# EAGLE design armwiz-board (EAGLE 6.5.0)
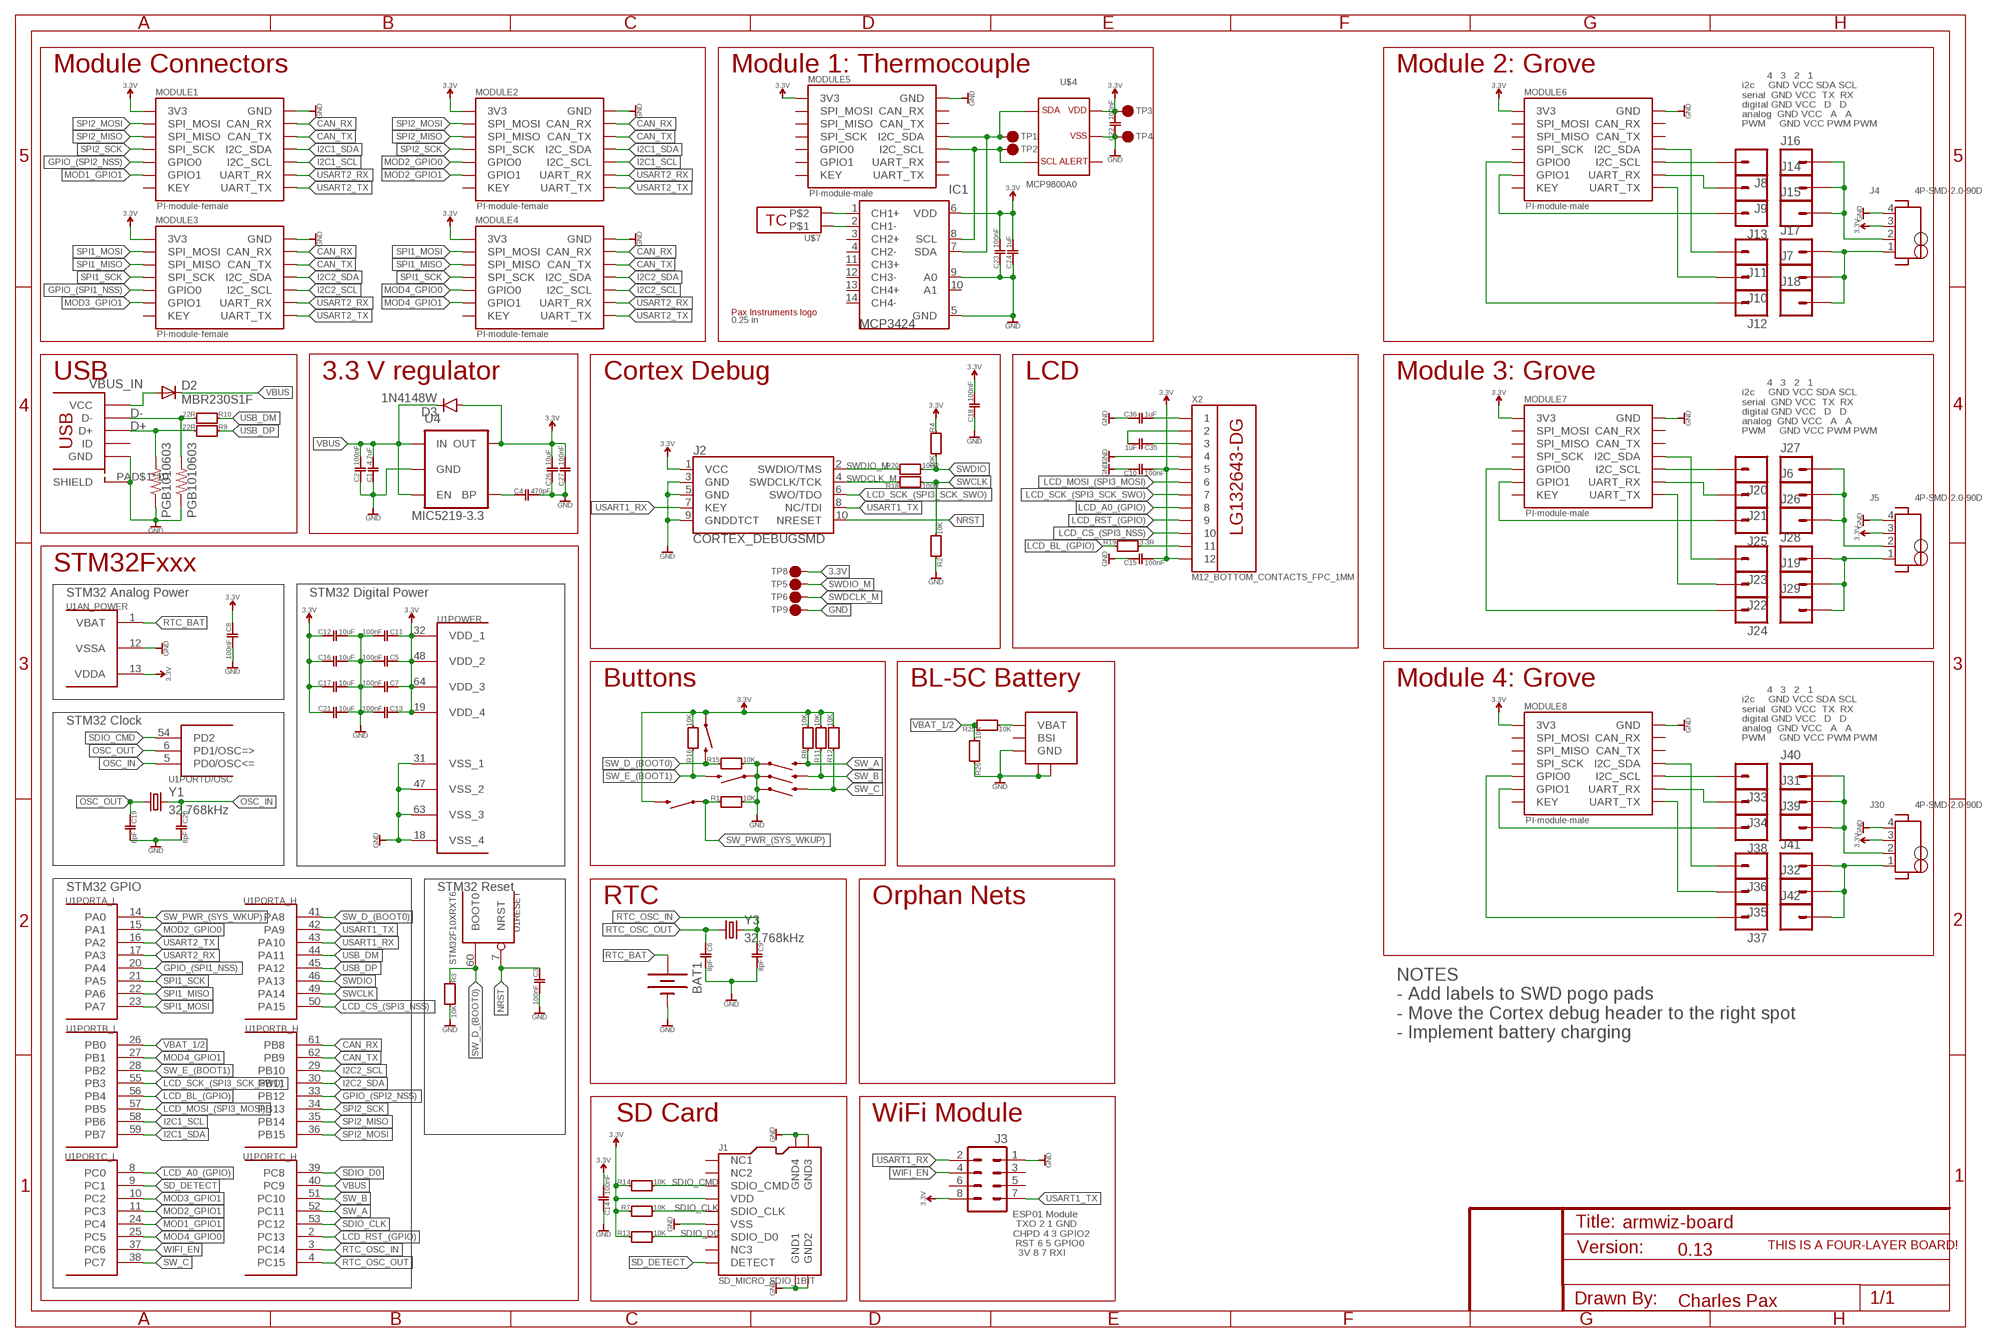
[diagram p0: schematic, sheet 1]

## Parts
BAT1  BATTERY12MM  [BATTCON_12MM]
C1  4.7uF  C0402_4.7UF  [0402]
C2  100nF  C0402_100NF  [0402]
C3  100nF  C0402_100NF  [0402]
C4  470pF  C0402_470PF  [0402]
C5  100nF  C0402_100NF  [0402]
C6  8pF  C0402_8PF  [0402]
C7  100nF  C0402_100NF  [0402]
C8  100nF  C0402_100NF  [0402]
C9  8pF  C0402_8PF  [0402]
C10  100nF  C0402_100NF  [0402]
C11  100nF  C0402_100NF  [0402]
C12  10uF  C0402_10UF  [0402]
C13  100nF  C0402_100NF  [0402]
C14  100nF  C0402_100NF  [0402]
C15  100nF  C0402_100NF  [0402]
C16  10uF  C0402_10UF  [0402]
C17  10uF  C0402_10UF  [0402]
C18  100nF  C0402_100NF  [0402]
C19  8pF  C0402_8PF  [0402]
C20  8pF  C0402_8PF  [0402]
C21  10uF  C0402_10UF  [0402]
C22  100nF  C0402_100NF  [0402]
C23  100nF  C0402_100NF  [0402]
C24  1uF  C0402_1UF  [0402]
C26  10uF  C0402_10UF  [0402]
C27  100nF  C0402_100NF  [0402]
C35  1uF  C0402_1UF  [0402]
C36  1uF  C0402_1UF  [0402]
D2  MBR230S1F  SPARKFUN-DISCRETESEMI_DIODESOD123SOD123  [SOD123]
D3  1N4148W  DIODESOD123  [SOD-123]
IC1  MCP3424  [SO14]
J1  SD_MICRO_SDIO_1BIT  [SD_MICRO_1]
J2  CORTEX_DEBUGSMD  [SAMTECH_FTSH-105-01]
J3  M04X2  [2X4]
J4  4P-SMD-2.0-90D  GROVE-CONNECTOR-SMD-90D(4+2P-2.0)  [HW4-SMD-2.0-90D]
J5  4P-SMD-2.0-90D  GROVE-CONNECTOR-SMD-90D(4+2P-2.0)  [HW4-SMD-2.0-90D]
J6  M01SMD-4.5X1.5  [PAD-1.5X4.5]
J7  M01SMD-4.5X1.5  [PAD-1.5X4.5]
J8  M01SMD-4.5X1.5  [PAD-1.5X4.5]
J9  M01SMD-4.5X1.5  [PAD-1.5X4.5]
J10  M01SMD-4.5X1.5  [PAD-1.5X4.5]
J11  M01SMD-4.5X1.5  [PAD-1.5X4.5]
J12  M01SMD-4.5X1.5  [PAD-1.5X4.5]
J13  M01SMD-4.5X1.5  [PAD-1.5X4.5]
J14  M01SMD-4.5X1.5  [PAD-1.5X4.5]
J15  M01SMD-4.5X1.5  [PAD-1.5X4.5]
J16  M01SMD-4.5X1.5  [PAD-1.5X4.5]
J17  M01SMD-4.5X1.5  [PAD-1.5X4.5]
J18  M01SMD-4.5X1.5  [PAD-1.5X4.5]
J19  M01SMD-4.5X1.5  [PAD-1.5X4.5]
J20  M01SMD-4.5X1.5  [PAD-1.5X4.5]
J21  M01SMD-4.5X1.5  [PAD-1.5X4.5]
J22  M01SMD-4.5X1.5  [PAD-1.5X4.5]
J23  M01SMD-4.5X1.5  [PAD-1.5X4.5]
J24  M01SMD-4.5X1.5  [PAD-1.5X4.5]
J25  M01SMD-4.5X1.5  [PAD-1.5X4.5]
J26  M01SMD-4.5X1.5  [PAD-1.5X4.5]
J27  M01SMD-4.5X1.5  [PAD-1.5X4.5]
J28  M01SMD-4.5X1.5  [PAD-1.5X4.5]
J29  M01SMD-4.5X1.5  [PAD-1.5X4.5]
J30  4P-SMD-2.0-90D  GROVE-CONNECTOR-SMD-90D(4+2P-2.0)  [HW4-SMD-2.0-90D]
J31  M01SMD-4.5X1.5  [PAD-1.5X4.5]
J32  M01SMD-4.5X1.5  [PAD-1.5X4.5]
J33  M01SMD-4.5X1.5  [PAD-1.5X4.5]
J34  M01SMD-4.5X1.5  [PAD-1.5X4.5]
J35  M01SMD-4.5X1.5  [PAD-1.5X4.5]
J36  M01SMD-4.5X1.5  [PAD-1.5X4.5]
J37  M01SMD-4.5X1.5  [PAD-1.5X4.5]
J38  M01SMD-4.5X1.5  [PAD-1.5X4.5]
J39  M01SMD-4.5X1.5  [PAD-1.5X4.5]
J40  M01SMD-4.5X1.5  [PAD-1.5X4.5]
J41  M01SMD-4.5X1.5  [PAD-1.5X4.5]
J42  M01SMD-4.5X1.5  [PAD-1.5X4.5]
MODULE1  PI-module-female  PAX_MODULE_EDGE_FEMALE_HOST  [M07X2_2MM_EDGE]
MODULE2  PI-module-female  PAX_MODULE_EDGE_FEMALE_HOST  [M07X2_2MM_EDGE]
MODULE3  PI-module-female  PAX_MODULE_EDGE_FEMALE_HOST  [M07X2_2MM_EDGE]
MODULE4  PI-module-female  PAX_MODULE_EDGE_FEMALE_HOST  [M07X2_2MM_EDGE]
MODULE5  PI-module-male  PAX_MODULE_EDGE_MALE_MODULE  [M07X2_2MM_EDGE]
MODULE6  PI-module-male  PAX_MODULE_EDGE_MALE_MODULE  [M07X2_2MM_EDGE]
MODULE7  PI-module-male  PAX_MODULE_EDGE_MALE_MODULE  [M07X2_2MM_EDGE]
MODULE8  PI-module-male  PAX_MODULE_EDGE_MALE_MODULE  [M07X2_2MM_EDGE]
R1  10K  R0402_10K  [0402]
R2  10K  R0402_10K  [0402]
R3  10K  R0402_10K  [0402]
R4  10K  R0402_10K  [0402]
R7  10K  R0402_10K  [0402]
R8  10K  R0402_10K  [0402]
R9  22R  R0402_22R  [R0402]
R10  22R  R0402_22R  [R0402]
R11  10K  R0402_10K  [0402]
R12  10K  R0402_10K  [0402]
R13  10K  R0402_10K  [0402]
R14  10K  R0402_10K  [0402]
R15  10K  R0402_10K  [0402]
R16  10K  R0402_10K  [0402]
R18  100R  R0402_100R  [0402]
R19  3.3R  R0402_3.3R  [0402]
R20  100R  R0402_100R  [0402]
R25  10K  R0402_10K  [0402]
R26  10K  R0402_10K  [0402]
S1  SWITCH-MOMENTARY-2SMD  [TACTILE_SWITCH_SMD]
S2  SWITCH-MOMENTARY-2SMD  [TACTILE_SWITCH_SMD]
S3  SWITCH-MOMENTARY-2SMD  [TACTILE_SWITCH_SMD]
S4  SWITCH-MOMENTARY-2SMD  [TACTILE_SWITCH_SMD]
S5  SWITCH-MOMENTARY-2SMD  [TACTILE_SWITCH_SMD]
S6  SWITCH-MOMENTARY-2SMD  [TACTILE_SWITCH_SMD]
TP1  M01_TH  [M01_TH]
TP2  M01_TH  [M01_TH]
TP3  M01_TH  [M01_TH]
TP4  M01_TH  [M01_TH]
TP5  M01_PAD_1MM  [PAD_1MM]
TP6  M01_PAD_1MM  [PAD_1MM]
TP8  M01_PAD_1MM  [PAD_1MM]
TP9  M01_PAD_1MM  [PAD_1MM]
U1  STM32F10XRXT6  [TQFP64]
U4  MIC5219-3.3V  V_REG_LDOSMD  [SOT23-5]
U$1  USB_MICROSMT+THRUHULE  [USB_MICRO_THRUHOLE]
U$2  FOUR_LAYER_WARNING  [FOUR_LAYER_WARNING]
U$3  BL-5C-CONNECTOR  [BL-5C-CONNECTOR]
U$4  MCP9800A0  [SOT23-5L]
U$5  LG132643-DG  [LG132643-DG]
U$7  THERMOCOUPLE_MINI_INSIDE  [THERMOCOUPLE_CLIP_INSIDE]
U$8  0.25 in  PAX-LOGO_0.25IN  [PAX-LOGO-0.25IN]
X2  M12_BOTTOM_CONTACTS_FPC_1MM  [FPC_12P_1MM]
Y1  32.768kHz  CRYSTAL3.2X1.5MM  [CRYSTAL-SMD-3.2X1.5MM]
Y3  32.768kHz  CRYSTAL3.2X1.5MM  [CRYSTAL-SMD-3.2X1.5MM]
Z1  PGB1010603  SPARKFUN-RESISTORS_RESISTOR0603-RES  [SPARKFUN-RESISTORS_0603-RES]
Z2  PGB1010603  SPARKFUN-RESISTORS_RESISTOR0603-RES  [SPARKFUN-RESISTORS_0603-RES]

## Nets
3.3V: C5.1 C7.1 C8.1 C10.2 C11.1 C12.1 C13.1 C14.2 C15.2 C16.1 C17.1 C18.2 C21.1 C26.2 C27.2 D3.A J1.4(VDD) J2.1(VCC) J3.8 MODULE1.P$1(3V3) MODULE2.P$1(3V3) MODULE3.P$1(3V3) MODULE4.P$1(3V3) R4.2 R7.2 R8.1 R11.1 R12.1 R13.2 R14.2 R16.1 S4.1 S6.3 TP8.P$1 U1.13(AN_POWER:VDDA) U1.19(POWER:VDD_4) U1.32(POWER:VDD_1) U1.48(POWER:VDD_2) U1.64(POWER:VDD_3) U4.5(OUT) X2.5 X2.12
3.3V_1: C22.2 C23.2 C24.2 IC1.6(VDD) MODULE5.P$13(3V3) TP3.P$1 U$4.1 ; supply symbol labelled 3.3V
3.3V_2: J4.3 MODULE6.P$13(3V3) ; supply symbol labelled 3.3V
3.3V_3: J5.3 MODULE7.P$13(3V3) ; supply symbol labelled 3.3V
3.3V_4: J30.3 MODULE8.P$13(3V3) ; supply symbol labelled 3.3V
CAN_RX: MODULE1.P$4(CAN_RX) MODULE2.P$4(CAN_RX) MODULE3.P$4(CAN_RX) MODULE4.P$4(CAN_RX) U1.61(PORTB_H:PB8)
CAN_TX: MODULE1.P$6(CAN_TX) MODULE2.P$6(CAN_TX) MODULE3.P$6(CAN_TX) MODULE4.P$6(CAN_TX) U1.62(PORTB_H:PB9)
D+: R9.1 U$1.PIN$3(D+) Z1.2
D-: R10.1 U$1.PIN$2(D-) Z2.2
GND [Ground]: BAT1.GND(-) C1.1 C2.1 C3.2 C4.2 C5.2 C6.2 C7.2 C8.2 C9.2 C10.1 C11.2 C12.2 C13.2 C14.1 C15.1 C16.2 C17.2 C18.1 C19.2 C20.2 C21.2 C26.1 C27.1 C36.1 J1.6(VSS) J1.G1(GND1) J1.G2(GND2) J1.G3(GND3) J1.G4(GND4) J2.3(GND) J2.5(GND) J2.9(GNDDTCT) J3.1 MODULE1.P$2(GND) MODULE2.P$2(GND) MODULE3.P$2(GND) MODULE4.P$2(GND) R1.1 R2.2 R3.1 R15.1 R26.2 S1.1 S2.1 S3.1 S5.1 TP9.P$1 U1.12(AN_POWER:VSSA) U1.18(POWER:VSS_4) U1.31(POWER:VSS_1) U1.47(POWER:VSS_2) U1.63(POWER:VSS_3) U4.2(GND) U$1.PAD$1(SHIELD) U$1.PAD$2(SHIELD) U$1.PAD$3(SHIELD) U$1.PAD$4(SHIELD) U$1.PAD$5(SHIELD) U$1.PAD$6(SHIELD) U$1.PAD$7(SHIELD) U$1.PAD$8(SHIELD) U$1.PAD$9(SHIELD) U$1.PAD$10(SHIELD) U$1.PIN$5(GND) U$3.P$3(GND) U$3.P$4 U$3.P$5 X2.4 Z1.1 Z2.1
GND_1 [Ground]: C22.1 C23.1 C24.1 IC1.5(GND) IC1.9(A0) MODULE5.P$14(GND) TP4.P$1 U$4.2 ; supply symbol labelled GND
GND_2 [Ground]: J4.4 MODULE6.P$14(GND) ; supply symbol labelled GND
GND_3 [Ground]: J5.4 MODULE7.P$14(GND) ; supply symbol labelled GND
GND_4 [Ground]: J30.4 MODULE8.P$14(GND) ; supply symbol labelled GND
GPIO_(SPI1_NSS): MODULE3.P$9(GPIO0) U1.20(PORTA_L:PA4)
GPIO_(SPI2_NSS): MODULE1.P$9(GPIO0) U1.33(PORTB_H:PB12)
I2C1_SCL: MODULE1.P$10(I2C_SCL) MODULE2.P$10(I2C_SCL) U1.58(PORTB_L:PB6)
I2C1_SDA: MODULE1.P$8(I2C_SDA) MODULE2.P$8(I2C_SDA) U1.59(PORTB_L:PB7)
I2C2_SCL: MODULE3.P$10(I2C_SCL) MODULE4.P$10(I2C_SCL) U1.29(PORTB_H:PB10)
I2C2_SDA [3.3V power]: MODULE3.P$8(I2C_SDA) MODULE4.P$8(I2C_SDA) U1.30(PORTB_H:PB11)
LCD_A0_(GPIO): U1.8(PORTC_L:PC0) X2.8
LCD_BL_(GPIO): R19.2 U1.56(PORTB_L:PB4)
LCD_CS_(SPI3_NSS): U1.50(PORTA_H:PA15) X2.10
LCD_MOSI_(SPI3_MOSI): U1.57(PORTB_L:PB5) X2.6
LCD_RST_(GPIO): U1.2(PORTC_H:PC13) X2.9
LCD_SCK_(SPI3_SCK_SWO): J2.6(SWO/TDO) U1.55(PORTB_L:PB3) X2.7
MOD1_GPIO1: MODULE1.P$11(GPIO1) U1.24(PORTC_L:PC4)
MOD2_GPIO0: MODULE2.P$9(GPIO0) U1.15(PORTA_L:PA1)
MOD2_GPIO1: MODULE2.P$11(GPIO1) U1.11(PORTC_L:PC3)
MOD3_GPIO1: MODULE3.P$11(GPIO1) U1.10(PORTC_L:PC2)
MOD4_GPIO0: MODULE4.P$9(GPIO0) U1.25(PORTC_L:PC5)
MOD4_GPIO1: MODULE4.P$11(GPIO1) U1.27(PORTB_L:PB1)
N$1: C4.1 U4.4(BP)
N$4: R19.1 X2.11
N$5: J4.2 J14.P$1 J15.P$1 J16.P$1
N$13: J5.2 J6.P$1 J26.P$1 J27.P$1
N$16: R25.1 U$3.P$1(VBAT)
N$25: IC1.2(CH1-) U$7.P$1
N$26: IC1.1(CH1+) U$7.P$2
N$37: C35.1 X2.3
N$38: C35.2 X2.2
N$39: C36.2 X2.1
N$42: J4.1 J7.P$1 J17.P$1 J18.P$1
N$43: J5.1 J19.P$1 J28.P$1 J29.P$1
N$45: J20.P$1 MODULE7.P$6(I2C_SCL)
N$47: J21.P$1 MODULE7.P$4(UART_RX)
N$51: J8.P$1 MODULE6.P$6(I2C_SCL)
N$52: J9.P$1 MODULE6.P$4(UART_RX)
N$53: J10.P$1 MODULE6.P$2(UART_TX)
N$54: J11.P$1 MODULE6.P$8(I2C_SDA)
N$55: J13.P$1 MODULE6.P$3(GPIO1)
N$56: J12.P$1 MODULE6.P$5(GPIO0)
N$57: J22.P$1 MODULE7.P$2(UART_TX)
N$58: J23.P$1 MODULE7.P$8(I2C_SDA)
N$59: J25.P$1 MODULE7.P$3(GPIO1)
N$60: J24.P$1 MODULE7.P$5(GPIO0)
N$61: J30.2 J31.P$1 J39.P$1 J40.P$1
N$62: J30.1 J32.P$1 J41.P$1 J42.P$1
N$63: J33.P$1 MODULE8.P$6(I2C_SCL)
N$64: J34.P$1 MODULE8.P$4(UART_RX)
N$65: J35.P$1 MODULE8.P$2(UART_TX)
N$66: J36.P$1 MODULE8.P$8(I2C_SDA)
N$67: J38.P$1 MODULE8.P$3(GPIO1)
N$68: J37.P$1 MODULE8.P$5(GPIO0)
NRST: C3.1 J2.10(NRESET) U1.7(RESET:NRST)
OSC_IN: C20.1 U1.5(PORTD/OSC:PD0/OSC<=) Y1.P$2
OSC_OUT: C19.1 U1.6(PORTD/OSC:PD1/OSC=>) Y1.P$1
RTC_BAT [RTC battery]: BAT1.PWR@1(+) U1.1(AN_POWER:VBAT)
RTC_OSC_IN: C9.1 U1.3(PORTC_H:PC14) Y3.P$2
RTC_OSC_OUT: C6.1 U1.4(PORTC_H:PC15) Y3.P$1
SCL_1: IC1.8(SCL) MODULE5.P$6(I2C_SCL) TP2.P$1 U$4.4
SD_DETECT: J1.9(DETECT) U1.9(PORTC_L:PC1)
SDA_1: IC1.7(SDA) MODULE5.P$8(I2C_SDA) TP1.P$1 U$4.5
SDIO_CLK: J1.5(SDIO_CLK) R7.1 U1.53(PORTC_H:PC12)
SDIO_CMD: J1.3(SDIO_CMD) R14.1 U1.54(PORTD/OSC:PD2)
SDIO_D0: J1.7(SDIO_D0) R13.1 U1.39(PORTC_H:PC8)
SPI1_MISO: MODULE3.P$5(SPI_MISO) MODULE4.P$5(SPI_MISO) U1.22(PORTA_L:PA6)
SPI1_MOSI: MODULE3.P$3(SPI_MOSI) MODULE4.P$3(SPI_MOSI) U1.23(PORTA_L:PA7)
SPI1_SCK: MODULE3.P$7(SPI_SCK) MODULE4.P$7(SPI_SCK) U1.21(PORTA_L:PA5)
SPI2_MISO: MODULE1.P$5(SPI_MISO) MODULE2.P$5(SPI_MISO) U1.35(PORTB_H:PB14)
SPI2_MOSI: MODULE1.P$3(SPI_MOSI) MODULE2.P$3(SPI_MOSI) U1.36(PORTB_H:PB15)
SPI2_SCK: MODULE1.P$7(SPI_SCK) MODULE2.P$7(SPI_SCK) U1.34(PORTB_H:PB13)
SW_A: R8.2 S3.3 U1.52(PORTC_H:PC11)
SW_B: R11.2 S2.3 U1.51(PORTC_H:PC10)
SW_C: R12.2 S1.3 U1.38(PORTC_L:PC7)
SW_D_(BOOT0): R3.2 R15.2 S4.3 U1.41(PORTA_H:PA8) U1.60(RESET:BOOT0)
SW_E_(BOOT1): R16.2 S5.3 U1.28(PORTB_L:PB2)
SW_PWR_(SYS_WKUP): R1.2 S6.1 U1.14(PORTA_L:PA0)
SWCLK: R2.1 R18.1 U1.49(PORTA_H:PA14)
SWDCLK_M: J2.4(SWDCLK/TCK) R18.2 TP6.P$1
SWDIO: R4.1 R20.1 U1.46(PORTA_H:PA13)
SWDIO_M: J2.2(SWDIO/TMS) R20.2 TP5.P$1
USART1_RX: J2.7(KEY) J3.2 U1.43(PORTA_H:PA10)
USART1_TX: J2.8(NC/TDI) J3.7 U1.42(PORTA_H:PA9)
USART2_RX: MODULE1.P$12(UART_RX) MODULE2.P$12(UART_RX) MODULE3.P$12(UART_RX) MODULE4.P$12(UART_RX) U1.17(PORTA_L:PA3)
USART2_TX: MODULE1.P$14(UART_TX) MODULE2.P$14(UART_TX) MODULE3.P$14(UART_TX) MODULE4.P$14(UART_TX) U1.16(PORTA_L:PA2)
USB_DM: R10.2 U1.44(PORTA_H:PA11)
USB_DP: R9.2 U1.45(PORTA_H:PA12)
VBAT_1/2: R25.2 R26.1 U1.26(PORTB_L:PB0)
VBUS [3.3V power]: C1.2 C2.2 D2.C D3.C U1.40(PORTC_H:PC9) U4.1(IN) U4.3(EN)
VBUS_IN [3.3V power]: D2.A U$1.PIN$1(VCC)
WIFI_EN: J3.4 U1.37(PORTC_L:PC6)
Unconnected: IC1.3(CH2+) IC1.4(CH2-) IC1.10(A1) IC1.11(CH3+) IC1.12(CH3-) IC1.13(CH4+) IC1.14(CH4-) J1.1(NC1) J1.2(NC2) J1.8(NC3) J3.3 J3.5 J3.6 J4.SS1 J4.SS2 J5.SS1 J5.SS2 J30.SS1 J30.SS2 MODULE1.P$13(KEY) MODULE2.P$13(KEY) MODULE3.P$13(KEY) MODULE4.P$13(KEY) MODULE5.P$1(KEY) MODULE5.P$2(UART_TX) MODULE5.P$3(GPIO1) MODULE5.P$4(UART_RX) MODULE5.P$5(GPIO0) MODULE5.P$7(SPI_SCK) MODULE5.P$9(SPI_MISO) MODULE5.P$10(CAN_TX) MODULE5.P$11(SPI_MOSI) MODULE5.P$12(CAN_RX) MODULE6.P$1(KEY) MODULE6.P$7(SPI_SCK) MODULE6.P$9(SPI_MISO) MODULE6.P$10(CAN_TX) MODULE6.P$11(SPI_MOSI) MODULE6.P$12(CAN_RX) MODULE7.P$1(KEY) MODULE7.P$7(SPI_SCK) MODULE7.P$9(SPI_MISO) MODULE7.P$10(CAN_TX) MODULE7.P$11(SPI_MOSI) MODULE7.P$12(CAN_RX) MODULE8.P$1(KEY) MODULE8.P$7(SPI_SCK) MODULE8.P$9(SPI_MISO) MODULE8.P$10(CAN_TX) MODULE8.P$11(SPI_MOSI) MODULE8.P$12(CAN_RX) U$1.PIN$4(ID) U$3.P$2(BSI) U$4.3

## Notes on the sheet
- Module Connectors | Module 1: Thermocouple | Module 2: Grove
- 4   3   2   1
  i2c     GND VCC SDA SCL
  serial  GND VCC  TX  RX
  digital GND VCC   D   D
  analog  GND VCC   A   A
  PWM     GND VCC PWM PWM
- USB | 3.3 V regulator | Cortex Debug | LCD | Module 3: Grove
- 4   3   2   1
  i2c     GND VCC SDA SCL
  serial  GND VCC  TX  RX
  digital GND VCC   D   D
  analog  GND VCC   A   A
  PWM     GND VCC PWM PWM
- MIC5219-3.3
- STM32Fxxx
- STM32 Analog Power | STM32 Digital Power
- Buttons | BL-5C Battery | Module 4: Grove
- 4   3   2   1
  i2c     GND VCC SDA SCL
  serial  GND VCC  TX  RX
  digital GND VCC   D   D
  analog  GND VCC   A   A
  PWM     GND VCC PWM PWM
- STM32 Clock
- STM32 GPIO | STM32 Reset
- RTC | Orphan Nets
- NOTES
  - Add labels to SWD pogo pads
  - Move the Cortex debug header to the right spot
  - Implement battery charging
- SD Card | WiFi Module
- ESP01 Module
   TXO 2 1 GND
  CHPD 4 3 GPIO2
   RST 6 5 GPIO0
    3V 8 7 RXI
- 0.13
- Charles Pax

## Library data of the parts
BAT1 = PaxInstruments-Electromechanical:BATTERY: Battery Holders Various common sizes : AA, AAA, 20mm coin cell and 12mm coin cell. 20MM_4LEGS, BATT-10373; MF: Keystone Electronics; MPN: 3000TR
C1-C24 C26 C27 C35 C36 = PaxInstruments-RCL:C0402
D2 = PaxInstrument-T400:SPARKFUN-DISCRETESEMI_DIODE: Diode These are standard reverse protection diodes and small signal diodes. SMA package can handle up to about 1A. SOD-323 can handle about 200mA. What the SOD-323 package when ordering, there are some mfgs out there that are 5-pin packages.; MF: DIODES INC; MPN: MBR230S1F-7
D3 = SparkFun-DiscreteSemi:DIODE: Diode These are standard reverse protection diodes and small signal diodes. SMA package can handle up to about 1A. SOD-323 can handle about 200mA. What the SOD-323 package when ordering, there are some mfgs out there that are 5-pin packages.
IC1 = PaxInstruments-DigitalIC:MCP3424: 18-Bit, 4-Channel Sampling ANALOG-TO-DIGITAL CONVERTER with I2C? Interface Source: www.ti.com .. ADS7828.pdf; MF: Microchip Technology; MPN: MCP3424-E/SL
J1 = PaxInstruments-Connectors:SD_MICRO_SDIO_1BIT
J2 = SparkFun-Connectors:CORTEX_DEBUG: Cortex Debug Connector Datasheet <http://infocenter.arm.com/help/topic/com.arm.doc.faqs/attached/13634/cortex_debug_connectors.pdf>
J3 = SparkFun-Connectors:M04X2: .1" header, two rows of four.
J4 J5 J30 = PaxInstruments-Connectors:GROVE-CONNECTOR-SMD-90D(4+2P-2.0): 320110032
J6-J29 J31-J42 = SparkFun-Connectors:M01: Header 1 Standard 1-pin 0.1" header. Use with straight break away headers (SKU : PRT-00116), right angle break away headers (PRT-00553), swiss pins (PRT-00743), machine pins (PRT-00117), and female headers (PRT-00115). SMTSO-256-ET is a "flush mount" nut for a 4-40 screw. The older package used to be too tight, and did not allow it to sit properly thru the drill hit. The latest (0.165DIA) fits nice and snug.
MODULE1-MODULE8 = PaxInstruments-Connectors:PAX_MODULE; MF: Pax Instruments; MPN: PIxxxx
R1-R4 R7 R8 R11-R16 R25 R26 = PaxInstruments-RCL:R0402; VALUE: _10K
R9 R10 = PaxInstruments-Resistors:R0402
R18-R20 = PaxInstruments-RCL:R0402
S1-S6 = SparkFun-Electromechanical:SWITCH-MOMENTARY-2: Various NO switches- pushbuttons, reed, etc; MF: C&K Components; MPN: RS-187R05A2-DS MT RT
TP1-TP6 TP8 TP9 = PaxInstruments-Connectors:M01
U1 = stm32:STM32F10XRXT6: STM32F101/103 64pin LQFP
U4 = SparkFun:V_REG_LDO: Voltage Regulator LDO Standard 150mA LDO voltage regulator in SOT-23 layout. Micrel part MIC5205. BP (by-pass) pin is used to lower output noise with 470pF cap.; MF: Micrel; MPN: MIC5219-3.3YM5 TR
U$1 = blinkinlabs:USB_MICRO; MF: FCI; MPN: 10118194-0001LF
U$2 = SparkFun-Aesthetics:FOUR_LAYER_WARNING: Warning text which will appear on both the schematic and the board file, notifying viewers that the design is a four-layer PCB.
U$3 = PaxInstruments-Connectors:BL-5C-CONNECTOR; MPN: BC-4-3P (77H)
U$4 = PaxInstruments-DigitalIC:MCP9800; I2C_ADDRESS: 000; MF: Microchip Technology; MPN: MCP9800A0T-M/OT
U$5 = charlespax:LG132643-DG; MPN: LG132643-DW
U$7 = PaxInstruments-Connectors:THERMOCOUPLE_MINI; MF: Pax Instruments; MPN: PI1024 (2x)
U$8 = PaxInstruments-Aesthetics:PAX-LOGO
X2 = PaxInstruments-Connectors:M12; MF: Hirose Connector; MPN: FH12-12S-1SH(55)
Y1 Y3 = SparkFun-FreqCtrl:CRYSTAL: Various standard crystals. Proven footprints.; PROD_ID: XTAL-13062
Z1 Z2 = PaxInstrument-T400:SPARKFUN-RESISTORS_RESISTOR: Resistor Basic schematic elements and footprints for 0603, 1206, and PTH resistors.; MF: Littelfuse; MPN: PGB1010603NRHF

## Net classes
0 Digital signal: width 0.075 mm, drill 0.2 mm, clearance 0.075 mm
1 3.3V power: width 0.075 mm, drill 0.2 mm, clearance 0.075 mm
2 RTC battery: width 0.075 mm, drill 0.2 mm, clearance 0.075 mm
3 5V power: width 0.075 mm, drill 0.2 mm, clearance 0.075 mm
4 Analog signal: width 0.075 mm, drill 0.2 mm, clearance 0.075 mm
5 Ground: width 0.075 mm, drill 0.2 mm, clearance 0.075 mm

## Board
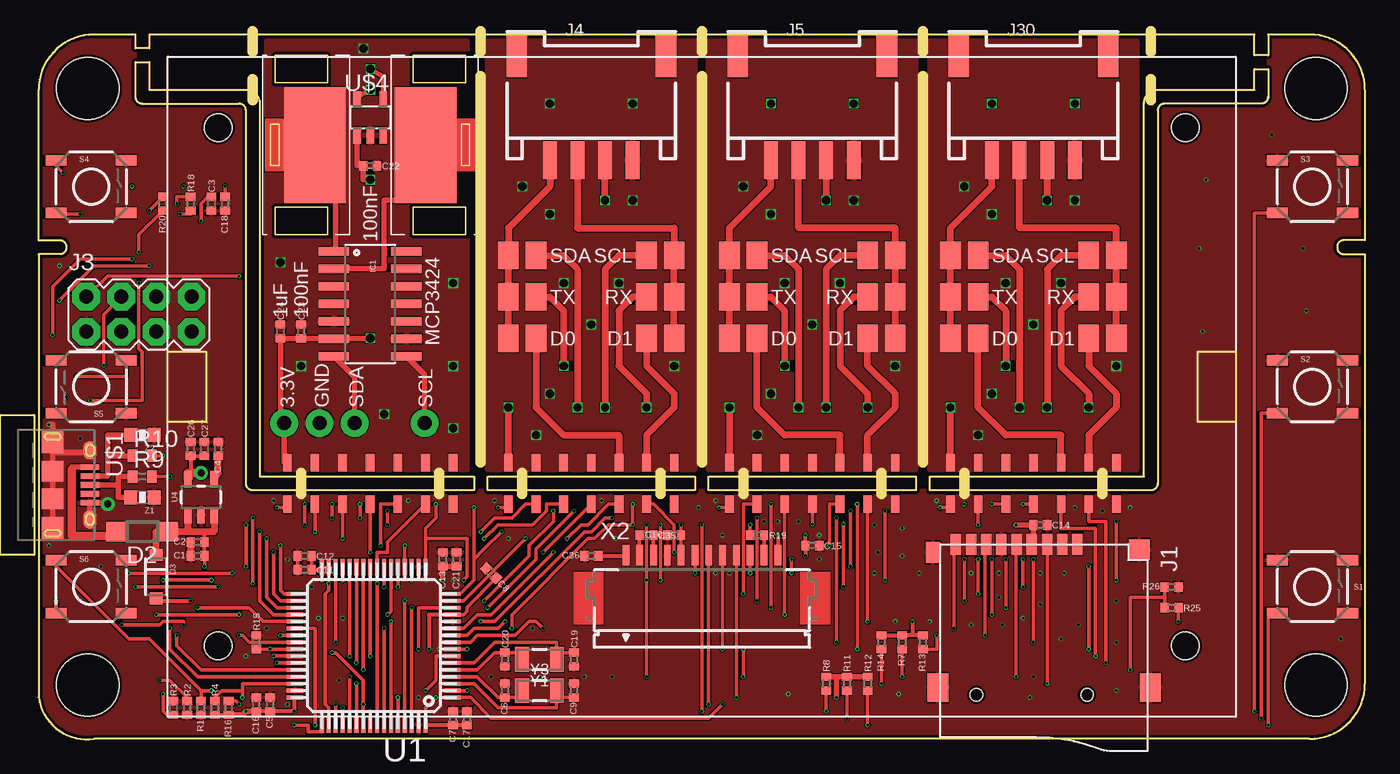
[diagram p1: board, top side]
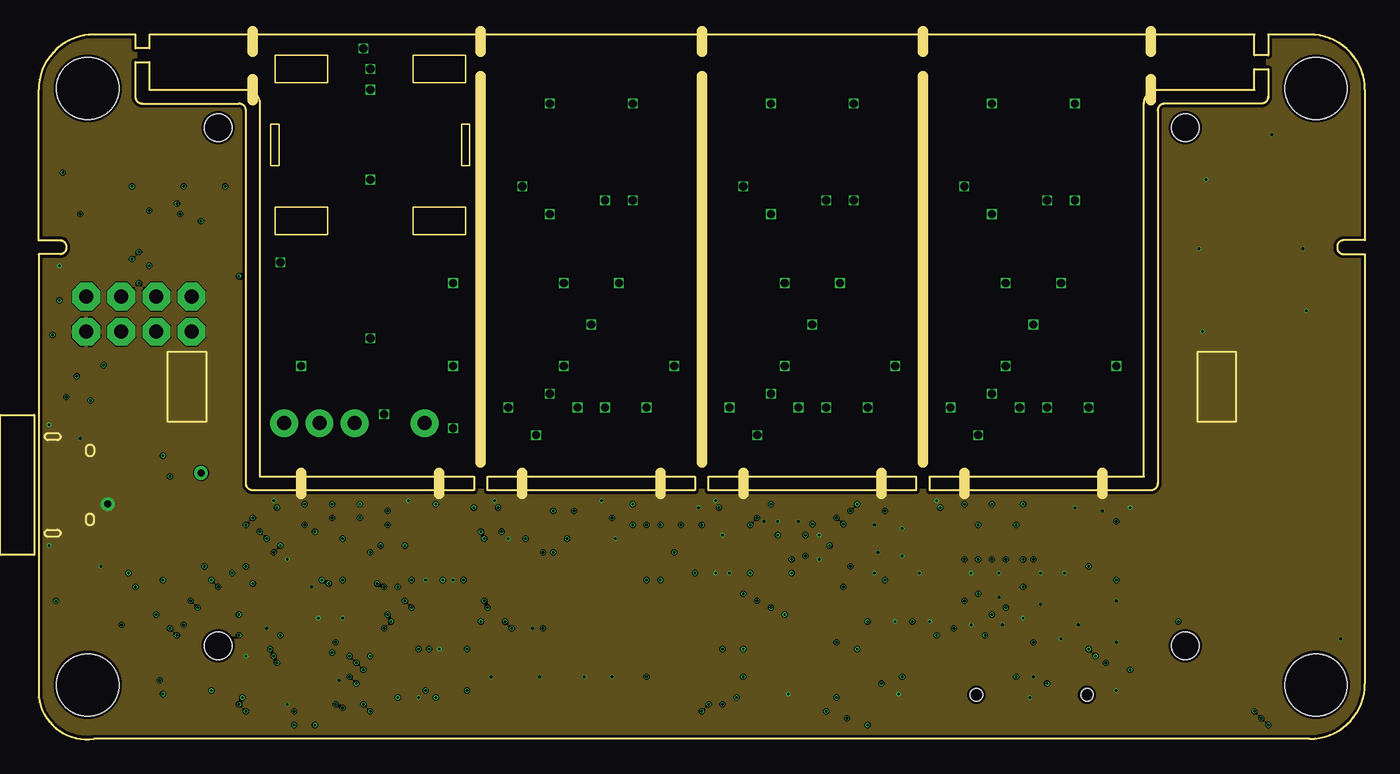
[diagram p2: board, inner layer GND]
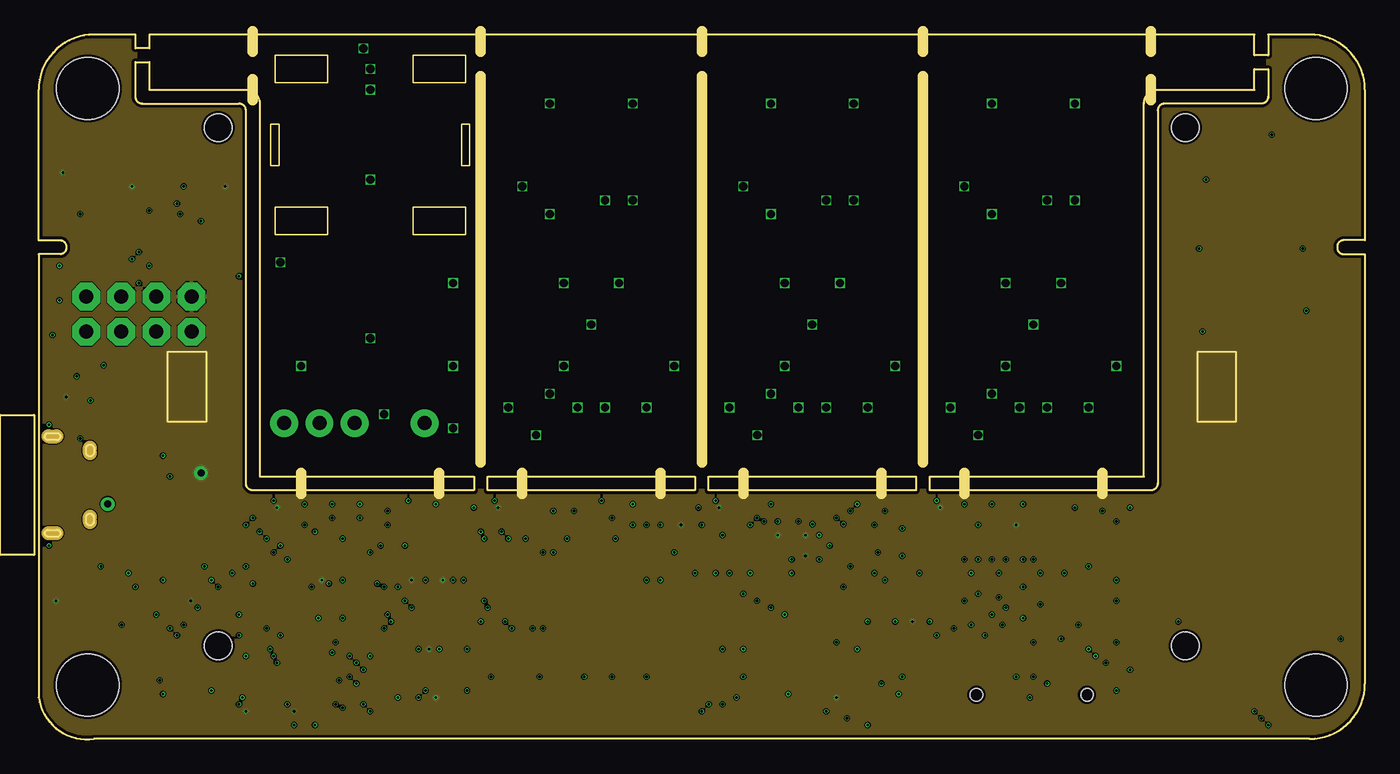
[diagram p3: board, inner layer 3.3V]
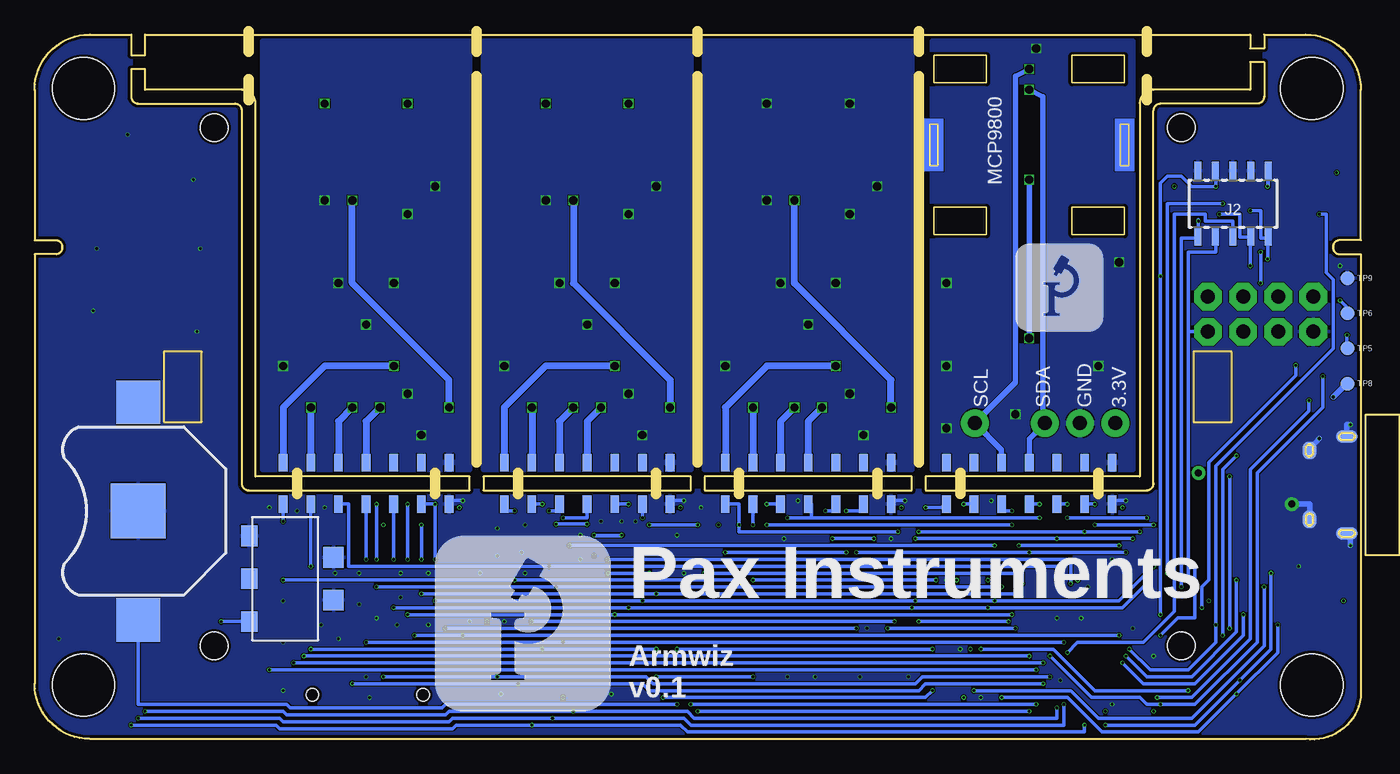
[diagram p4: board, bottom side, seen from below]

Size 96 x 51.03 mm. Coordinates in mm from the lower left corner, seen from the top.
Outline: 92,0.03 4,0.03 arc-90 0,3.03 0,35.13 1.6,35.13 arc90 2,35.63 arc90 1.6,36.13 0,36.13 0,47.03 arc-90 4,51.03 7,51.03 7,50.03 8,50.03 8,51.03 88,51.03 88,49.53 89,49.53 89,51.03 92,51.03 arc-90 96,47.03 96,36.13 94.4,36.13 arc90 94,35.63 arc90 94.4,35.13 96,35.13 96,4.03 arc-90 92,0.03
Outline: 89,48.53 89,46.53 arc-90 88.5,46.03 81.5,46.03 arc90 81,45.53 81,18.53 arc-90 80.5,18.03 64.5,18.03 64.5,19.03 80,19.03 80,46.03 arc-90 81,47.03 88,47.03 88,48.53 89,48.53
Outline: 63.5,18.03 48.5,18.03 48.5,19.03 63.5,19.03 63.5,18.03
Outline: 47.5,18.03 32.5,18.03 32.5,19.03 47.5,19.03 47.5,18.03
Outline: 31.5,18.03 15.5,18.03 arc-90 15,18.53 15,45.53 arc90 14.5,46.03 7.5,46.03 arc-90 7,46.53 7,49.03 8,49.03 8,47.03 15,47.03 arc-90 16,46.03 16,19.03 31.5,19.03 31.5,18.03
Copper layers (1*2+15*16): Top 0.017mm / dielectric 0.5mm / GND 0.017mm / dielectric 0.075mm / 3.3V 0.017mm / dielectric 0.5mm / Bottom 0.017mm
Design rules "PaxInstrument-T400 *": minimum track width 0.1mm, minimum drill 0.2mm, track to track 0.075mm, track to pad 0.075mm, pad to pad 0.075mm, via to via 0.075mm, smd to smd 0.075mm, copper to edge 0.2mm, drill to drill 0.2mm, minimum pad ring 0.5mm, minimum via ring 0.05mm, stop-mask expansion 0.01mm, vias tented up to drill 0.25mm, thermal gap 0.1mm
Holes 4.5 mm at 92.45,3.94 92.45,47.12 3.55,47.12 3.55,3.94
tKeepout: area 0,0.4 to 7,7.4; area 0,43.6 to 7.1,50.6; area 89,43.6 to 96,50.6; area 89,0.4 to 96,7.4
vRestrict: area 15,1.4 to 81,52.2
Milling: 22 lines

### Footprints (pad centres in the part's own frame; a part is rotated, then mirrored left to right if it is on the bottom)
BATTCON_12MM = smd 3.962 x 3.962: GND 0,0 | smd 3.175 x 3.175: PWR@1 -7.874,0; PWR@2 7.874,0
0402 = smd 0.6 x 0.7: 1 -0.5,0; 2 0.5,0
SOD123 = smd 1.4 x 1.4: A 1.9,0; C -1.9,0
SOD-123 = smd 0.9 x 0.95: A 1.575,0; C -1.575,0
SO14 = smd 0.61 x 2.21: 1 -3.81,-2.616; 2 -2.54,-2.616; 3 -1.27,-2.616; 4 0,-2.616; 5 1.27,-2.616; 6 2.54,-2.616; 7 3.81,-2.616; 8 3.81,2.616; 9 2.54,2.616; 10 1.27,2.616; 11 0,2.616; 12 -1.27,2.616; 13 -2.54,2.616; 14 -3.81,2.616
SD_MICRO_1 = smd 1.524 x 0.762: 1 -7.493,2.414; 2 -7.493,1.314; 3 -7.493,0.214; 4 -7.493,-0.886; 5 -7.493,-1.986; 6 -7.493,-3.086; 7 -7.493,-4.186; 8 -7.493,-5.286; 9 -7.493,-6.386 | smd 1.524 x 1.016: G1 -6.893,-8.032 | smd 2.032 x 1.524: G2 2.88,-7.686; G3 2.88,7.714 | smd 1.524 x 1.524: G4 -7.101,6.895 | hole 0.889: 3.407,-4.886; 3.407,3.114
SAMTECH_FTSH-105-01 = smd 0.508 x 1.27: 1 -2.54,-2.413; 2 -2.54,2.413; 3 -1.27,-2.413; 4 -1.27,2.413; 5 0,-2.413; 6 0,2.413; 7 1.27,-2.413; 8 1.27,2.413; 9 2.54,-2.413; 10 2.54,2.413
2X4 = drill 1.016 pad 1.88 octagon: 1 -3.81,-1.27; 2 -3.81,1.27; 3 -1.27,-1.27; 4 -1.27,1.27; 5 1.27,-1.27; 6 1.27,1.27; 7 3.81,-1.27; 8 3.81,1.27
HW4-SMD-2.0-90D = smd 1.01 x 2.74: 1 -3,-0.1; 2 -1,-0.1; 3 1,-0.1; 4 3,-0.1 | smd 1.5 x 3: SS1 -5.4,7.4; SS2 5.4,7.4
PAD-1.5X4.5 = smd 1.5 x 2: P$1 0,0
M07X2_2MM_EDGE = smd 0.635 x 1.27: P$1 0,0; P$3 2,0; P$5 4,0; P$7 6,0; P$9 8,0; P$11 10,0; P$13 12,0 | smd 0.635 x 1.27 bottom: P$2 0,0; P$4 2,0; P$6 4,0; P$8 6,0; P$10 8,0; P$12 10,0; P$14 12,0
R0402 = smd 0.7 x 0.9: 1 -0.7,0; 2 0.7,0
TACTILE_SWITCH_SMD = smd 1.524 x 0.762: 1 -2.54,1.905; 2 2.54,1.905; 3 -2.54,-1.905; 4 2.54,-1.905
M01_TH = drill 1.016 pad 1.88: P$1 0,0
PAD_1MM = smd 1 x 1: P$1 0,0
TQFP64 = smd 1.2 x 0.3: 1 -5.7,3.75; 2 -5.7,3.25; 3 -5.7,2.75; 4 -5.7,2.25; 5 -5.7,1.75; 6 -5.7,1.25; 7 -5.7,0.75; 8 -5.7,0.25; 9 -5.7,-0.25; 10 -5.7,-0.75; 11 -5.7,-1.25; 12 -5.7,-1.75; 13 -5.7,-2.25; 14 -5.7,-2.75; 15 -5.7,-3.25; 16 -5.7,-3.75; 33 5.7,-3.75; 34 5.7,-3.25; 35 5.7,-2.75; 36 5.7,-2.25; 37 5.7,-1.75; 38 5.7,-1.25; 39 5.7,-0.75; 40 5.7,-0.25; 41 5.7,0.25; 42 5.7,0.75; 43 5.7,1.25; 44 5.7,1.75; 45 5.7,2.25; 46 5.7,2.75; 47 5.7,3.25; 48 5.7,3.75 | smd 0.3 x 1.2: 17 -3.75,-5.7; 18 -3.25,-5.7; 19 -2.75,-5.7; 20 -2.25,-5.7; 21 -1.75,-5.7; 22 -1.25,-5.7; 23 -0.75,-5.7; 24 -0.25,-5.7; 25 0.25,-5.7; 26 0.75,-5.7; 27 1.25,-5.7; 28 1.75,-5.7; 29 2.25,-5.7; 30 2.75,-5.7; 31 3.25,-5.7; 32 3.75,-5.7; 49 3.75,5.7; 50 3.25,5.7; 51 2.75,5.7; 52 2.25,5.7; 53 1.75,5.7; 54 1.25,5.7; 55 0.75,5.7; 56 0.25,5.7; 57 -0.25,5.7; 58 -0.75,5.7; 59 -1.25,5.7; 60 -1.75,5.7; 61 -2.25,5.7; 62 -2.75,5.7; 63 -3.25,5.7; 64 -3.75,5.7
SOT23-5 = smd 0.55 x 1.2: 1 -0.95,-1.3; 2 0,-1.3; 3 0.95,-1.3; 4 0.95,1.3; 5 -0.95,1.3
USB_MICRO_THRUHOLE = smd 1.645 x 1.55: PAD$1 -3.123,0; PAD$4 3.123,0 | smd 1.5 x 1.55: PAD$2 -1,0; PAD$3 1,0 | smd 1.25 x 0.95: PAD$5 -2.5,2.7; PAD$6 2.5,2.7 | smd 0.9 x 1.55 bottom: PAD$7 -3.5,0; PAD$8 3.5,0 | smd 1.25 x 0.95 bottom: PAD$9 -2.5,2.7; PAD$10 2.5,2.7 | smd 0.4 x 1.35: PIN$1 -1.3,2.7; PIN$2 -0.65,2.7; PIN$3 0,2.7; PIN$4 0.65,2.7; PIN$5 1.3,2.7
BL-5C-CONNECTOR = smd 1.5 x 1.2: P$1 3.1,-0.2; P$2 0,-0.2; P$3 -3.1,-0.2 | smd 1.5 x 1.5: P$4 1.55,5.9; P$5 -1.55,5.9
SOT23-5L = smd 0.55 x 1.2: 1 -0.95,-1.3; 2 0,-1.3; 3 0.95,-1.3; 4 0.95,1.3; 5 -0.95,1.3
LG132643-DG = hole 2: -35,-18.75; 35,-18.75; 35,18.75; -35,18.75
THERMOCOUPLE_CLIP_INSIDE = smd 4.5 x 8.4: P$1 -4,0; P$2 4,0
FPC_12P_1MM = smd 0.5 x 1.5: 1 -5.5,2.297; 2 -4.5,2.297; 3 -3.5,2.297; 4 -2.5,2.297; 5 -1.5,2.297; 6 -0.5,2.297; 7 0.5,2.297; 8 1.5,2.297; 9 2.5,2.297; 10 3.5,2.297; 11 4.5,2.297; 12 5.5,2.297
CRYSTAL-SMD-3.2X1.5MM = smd 1 x 1.8: P$1 -1.25,0; P$2 1.25,0
SPARKFUN-RESISTORS_0603-RES = smd 0.94 x 1.016: 1 -0.85,0; 2 0.85,0

### Placement (x,y rotation side)
BAT1  88.5,16.53 90 bottom
C1  11.5,13.28 0 top
C2  11.5,14.28 0 top
C3  12.5,38.78 270 top
C4  13,21.03 90 top
C5  16.75,2.53 90 top
C6  33.75,3.53 90 top
C7  30,1.53 90 top
C8  32.75,12.03 135 top
C9  38.75,3.53 90 top
C10  46,14.78 0 top
C11  19.25,12.28 180 top
C12  19.25,13.28 180 top
C13  29.25,13.03 90 top
C14  72.5,15.53 180 top
C15  56,14.03 180 top
C16  15.75,2.53 90 top
C17  31,1.53 90 top
C18  13.5,38.78 90 top
C19  38.75,5.78 270 top
C20  33.75,5.78 270 top
C21  30.25,13.03 90 top
C22  24,41.53 180 top
C23  19,29.53 270 top
C24  17.5,29.53 270 top
C26  11,21.03 270 top
C27  12,21.03 270 top
C35  44,14.78 180 top
C36  40,13.28 0 top
D2  7.5,15.03 180 top
D3  8.5,11.78 270 top
IC1  24,31.53 270 top
J1  72.77,6.63 270 top
J2  9.25,38.78 180 bottom
J3  7.25,30.78 0 top
J4  40,42.03 0 top
J5  56,42.03 0 top
J6  62,32.03 0 top
J7  34,32.03 0 top
J8  44,35.03 0 top
J9  44,32.03 0 top
J10  36,32.03 0 top
J11  36,35.03 0 top
J12  36,29.03 0 top
J13  44,29.03 0 top
J14  46,32.03 0 top
J15  46,29.03 0 top
J16  46,35.03 0 top
J17  34,35.03 0 top
J18  34,29.03 0 top
J19  50,32.03 0 top
J20  60,35.03 0 top
J21  60,32.03 0 top
J22  52,32.03 0 top
J23  52,35.03 0 top
J24  52,29.03 0 top
J25  60,29.03 0 top
J26  62,29.03 0 top
J27  62,35.03 0 top
J28  50,35.03 0 top
J29  50,29.03 0 top
J30  72,42.03 0 top
J31  78,32.03 0 top
J32  66,32.03 0 top
J33  76,35.03 0 top
J34  76,32.03 0 top
J35  68,32.03 0 top
J36  68,35.03 0 top
J37  68,29.03 0 top
J38  76,29.03 0 top
J39  78,29.03 0 top
J40  78,35.03 0 top
J41  66,35.03 0 top
J42  66,29.03 0 top
MODULE1  18,17.03 0 top
MODULE2  34,17.03 0 top
MODULE3  50,17.03 0 top
MODULE4  66,17.03 0 top
MODULE5  30,20.03 180 top
MODULE6  46,20.03 180 top
MODULE7  62,20.03 180 top
MODULE8  78,20.03 180 top
R1  11.75,2.28 90 top
R2  10.75,2.28 270 top
R3  9.75,2.28 270 top
R4  12.75,2.28 270 top
R7  62.5,7.03 90 top
R8  57,4.03 270 top
R9  7.5,19.03 0 top
R10  7.5,20.53 0 top
R11  58.5,4.03 270 top
R12  60,4.03 270 top
R13  64,7.03 90 top
R14  61,7.03 90 top
R15  15.75,7.03 270 top
R16  13.75,2.28 90 top
R18  11,38.78 270 top
R19  52,14.78 180 top
R20  9,38.78 90 top
R25  82,9.53 180 top
R26  82,11.03 0 top
S1  92.2,11.05 0 top
S2  92.2,25.53 0 top
S3  92.2,40.01 0 top
S4  3.8,40.01 0 top
S5  3.8,25.53 180 top
S6  3.8,11.05 0 top
TP1  22.86,22.89 0 top
TP2  27.94,22.89 0 top
TP3  17.78,22.89 0 top
TP4  20.32,22.89 0 top
TP5  0.98,28.3 180 bottom
TP6  0.98,30.84 180 bottom
TP8  0.98,25.76 180 bottom
TP9  0.98,33.38 180 bottom
U1  24.25,6.78 180 top
U4  11.75,17.53 0 top
U$1  1.01,18.42 270 top
U$2  0,-2.97 0 top
U$3  80.26,11.63 270 bottom
U$4  24,45.03 0 top
U$5  48,25.53 0 bottom
U$6  [PAX-LOGO-0.5IN]  67,2.03 0 bottom
U$7  24,43.03 180 top
U$8  25,29.53 0 bottom
X2  48,11.03 0 top
Y1  36.25,5.78 180 top
Y3  36.25,3.53 0 top
Z1  7.5,17.53 180 top
Z2  7.5,22.03 180 top

### Tracks (layer width: path | path; a pad name or v marks a point on that pad's centre or on a via)
3.3V  (via drill 0.2, 0.5 pad 1)
  Top 0.25: C7.1 C17.1 | C12.1 C11.1 20.5,12.28 U1.32 | X2.5 C10.2 v46.5,15.53 | U1.13 30.75,9.03 31,9.28 31,9.58 C8.1 | C18.2 v13.5,40.03 | R4.2 R16.1 | S4.1 1.26,41.52 v1.75,41.03
  Top 0.254: v17.25,16.78 17.75,16.78 MODULE1.P$1 | v33.25,16.78 33.75,16.78 MODULE2.P$1 | v65.25,16.78 65.75,16.78 MODULE4.P$1 | v49.25,16.78 49.75,16.78 MODULE3.P$1 | U1.32 v20.5,11.53
  Top 0.305: C17.1 28,1.03 U1.64 28,2.28 v28.75,3.03 | U1.19 v27,11.53 | v55.5,14.78 C15.2 v55.5,13.28 | v53.5,14.78 X2.12 | U1.48 18.5,3.03 v18.5,2.03 C5.1 C16.1 | U1.13 28.25,9.03 v28.25,6.53 | R14.2 R7.2 63.25,7.53 | R13.2 63.25,7.53 | v63.25,8.53 63.25,7.53 | C27.2 C26.2 11,18.83 U4.5 | D3.A 8.5,10.03 v11,10.03 | S6.3 1.26,10.03 v1.25,10.03
  Top 0.406: v29.25,11.53 C13.1 C21.1 | J1.4 72,14.13 C14.2 v70.75,15.53 | R8.1 57.75,4.53 | 57.75,4.53 v57.75,3.03 | R12.1 R11.1 57.75,4.53 | R16.1 14.75,1.78 v15,2.03 C16.1
  Top 0.61: v11.75,19.28 10.8,19.28 U4.5
  Bottom 0.305: v55.5,14.78 v53.5,14.78 | J2.1 6.75,41.2 v6.75,40.03
  Bottom 0.406: TP8.P$1 1.02,25.76 v2,24.78
  pour 3.3V: 96,51.03 96,0.03 0,0.03 0,51.03 6.5,51.03 arc-90 7,50.53 7,46.03 14.5,46.03 arc-90 15,45.53 15,18.03 80.5,18.03 arc90 81,18.53 81,19.03 81,46.03 88.5,46.03 arc90 89,46.53 89,51.03
3.3V_1  (via drill 0.6)
  Top 0.406: 21.38,29.03 C23.2 C24.2 17.5,22.89 TP3.P$1 17.78,20.03 MODULE5.P$13 | 21.38,29.03 IC1.6 | U$4.1 23.05,41.53 C22.2 23.5,40.53 v24,40.53 | 21.38,29.03 v24,29.03
  Bottom 0.406: v24,29.03 v24,40.53
3.3V_2  (via drill 0.6)
  Top 0.5: MODULE6.P$13 v34,24.03 | v41,39.03 J4.3
  Bottom 0.5: v34,24.03 34,26.03 41,33.03 v41,39.03
3.3V_3  (via drill 0.6)
  Top 0.5: J5.3 v57,39.03 | v50,24.03 MODULE7.P$13
  Bottom 0.5: v57,39.03 57,33.03 50,26.03 v50,24.03
3.3V_4  (via drill 0.6)
  Top 0.5: MODULE8.P$13 v66,24.03 | v73,39.03 J30.3
  Bottom 0.5: v66,24.03 66,26.03 73,33.03 v73,39.03
CAN_RX  (via drill 0.2)
  Top 0.25: v15,15.53 v15,12.53 | v52,16.03 v52,10.03 | v67,10.03 v67,13.03 | v19.25,15.53 v19.25,17.03 | v32.25,10.03 35.5,13.28 35.5,14.03 37.25,15.78 v37.25,16.53 | U1.61 v26.5,10.03
  Bottom 0.25: v15,12.53 17.5,10.03 v26.5,10.03 v32.25,10.03 v52,10.03 v67,10.03 | v19.25,17.03 MODULE1.P$4 | MODULE2.P$4 36,16.53 v37.25,16.53 | 52,17.53 MODULE3.P$4 v52,16.03 | MODULE4.P$4 v67,17.03 v67,13.03 | v15,15.53 v19.25,15.53
CAN_TX  (via drill 0.2, 0.2 pad 0.25)
  Top 0.25: v70,9.53 v70,13.03 | v53,17.03 v53,9.53 | v15.5,16.03 v15.5,11.28 | v21.25,16.03 v21.25,17.03 | v32.5,9.53 36,13.03 36,13.78 v38.75,16.53 | U1.62 v27,9.53
  Bottom 0.25: MODULE1.P$6 v21.25,17.03 | v53,17.03 MODULE3.P$6 | v70,9.53 v53,9.53 v32.5,9.53 v27,9.53 17.25,9.53 v15.5,11.28 | v70,13.03 MODULE4.P$6 | v15.5,16.03 v21.25,16.03 | MODULE2.P$6 38,16.53 v38.75,16.53
D+
  Top 0.406: U$1.PIN$3 5.75,18.42 | 5.75,18.42 5.75,17.53 Z1.2 | R9.1 5.75,19.03 5.75,18.42
D-
  Top 0.406: U$1.PIN$2 5,19.07 5,20.53 | 5,20.53 R10.1 | Z2.2 5,22.03 5,20.53
GND  (via drill 0.2, 0.5 pad 1)
  Top 0.25: C11.2 C12.2
  Top 0.406: v5,17.03 5,17.12 U$1.PIN$5 U$1.PAD$10 | 8.5,17.53 Z1.1 | U$1.PAD$4 U$1.PAD$3 U$1.PAD$2 1.01,20.78 | 1.01,20.78 U$1.PAD$1 1.01,22.78 v0.75,22.78 | U$1.PAD$9 3.71,20.78 1.01,20.78
  Top 0.5: C2.1 C1.1
  Bottom 0.254: v17,17.28 17.75,17.28 MODULE1.P$2 | v33,17.28 33.75,17.28 MODULE2.P$2 | v49,17.28 49.75,17.28 MODULE3.P$2 | v65,17.28 65.75,17.28 MODULE4.P$2
  Bottom 0.406: U$1.PAD$7 1.01,22.78 v0.75,22.78 | U$1.PAD$8 0.75,14.92 v0.75,14.03 | U$1.PAD$9 3.75,20.92 v3,21.78 | U$1.PAD$10 3.71,17.03 v5,17.03
  other vias: 18,13.03 56.5,14.78 28,11.53 29,6.53 30,11.53 27.5,3.03 41.5,4.53 32.75,4.53 36.25,4.53 39.5,4.53 22,8.78 26.75,17.28 40.75,17.28 53.5,15.78 52.5,15.78 49.5,14.78 47.75,16.78 49,12.03 50,12.03 55,15.78 56.5,13.03 60.5,15.53 60.75,13.53 60.5,12.03 62,8.53 64.5,8.53 62.5,13.28 62.5,15.28 63.75,12.03 67.5,8.28 69.5,10.28 69.75,8.28 71.25,8.78 72.5,9.78 72.5,12.03 69.5,12.03 67.5,12.03 74.25,12.03 74,7.28 75.25,8.28 78,10.03 78,7.03 75,16.78 77,16.53 79,16.78 72,4.53 20.25,8.78 19.75,11.03 41.75,14.53 35.75,8.03 71.75,3.03 34,14.53 21.75,4.28 18,2.53 54.25,3.28 62.25,3.28 78,3.53 94.25,7.28 84.25,29.53 91.75,31.03 84,35.53 91.5,35.53 84.5,40.53 89.25,43.78 4.5,12.53 15,6.03 16.5,8.03 1.5,34.28
  pour GND: 96,51.03 96,0.03 0,0.03 0,51.03 6.5,51.03 arc-90 7,50.53 7,46.03 15,46.03 15,18.03 81,18.03 81,46.03 89,46.03 89,51.03
  pour Bottom: 0,51.03 6.5,51.03 arc-90 7,50.53 7,46.03 14.5,46.03 arc-90 15,45.53 15,18.03 80.5,18.03 arc90 81,18.53 81,46.03 88.5,46.03 arc90 89,46.53 89,51.03 96,51.03 96,0.03 0,0.03
  pour Top: 96,51.03 89,51.03 89,46.03 81,46.03 81,18.03 15,18.03 15,46.03 7,46.03 7,50.53 arc90 6.5,51.03 0,51.03 0,0.03 96,0.03
GND_1  (via drill 0.6)
  other vias: 30,33.03 30,27.03 30,22.53 25,23.53 19,27.03 17.5,34.53 23.5,50.03
  pour Top: 16.5,50.53 16.5,19.53 31,19.53 31,50.53
  pour Bottom: 16.5,50.53 16.5,19.53 31,19.53 31,50.53
GND_2  (via drill 0.6)
  other vias: 36,22.03 37,25.03 43,39.03 35,40.03 37,46.03 43,46.03 40,30.03 46,27.03 38,33.03 42,33.03 37,38.03
  pour Bottom: 32.5,50.53 32.5,19.53 47.5,19.53 47.5,50.53
  pour Top: 32.5,50.53 32.5,19.53 47.5,19.53 47.5,50.53
GND_3  (via drill 0.6)
  other vias: 51,40.03 53,38.03 59,39.03 54,33.03 58,33.03 56,30.03 62,27.03 53,25.03 52,22.03
  pour Bottom: 48.5,50.53 48.5,19.53 63.5,19.53 63.5,50.53
  pour Top: 48.5,50.53 48.5,19.53 63.5,19.53 63.5,50.53
GND_4  (via drill 0.6)
  other vias: 67,40.03 69,38.03 75,39.03 70,33.03 74,33.03 72,30.03 78,27.03 69,25.03 68,22.03
  pour Top: 64.5,50.53 64.5,19.53 79.5,19.53 79.5,50.53
  pour Bottom: 64.5,50.53 64.5,19.53 79.5,19.53 79.5,50.53
GND_5  (via drill 0.6)
  other vias: 53,46.03 59,46.03
GND_6  (via drill 0.6)
  other vias: 69,46.03 75,46.03
GPIO_(SPI1_NSS)  (via drill 0.2)
  Top 0.25: U1.20 v26.5,14.03 | v57.25,14.03 57.25,17.03 MODULE3.P$9
  Bottom 0.25: v26.5,14.03 v57.25,14.03
GPIO_(SPI2_NSS)  (via drill 0.2)
  Top 0.25: U1.33 17.75,10.53 17.5,10.78 v17.5,14.03 | MODULE1.P$9 24.75,17.03 v24.75,14.03
  Bottom 0.25: v17.5,14.03 v24.75,14.03
I2C1_SCL  (via drill 0.2)
  Top 0.25: U1.58 v25,8.03 | v34.25,8.03 34.25,9.03 39.75,14.53 40.25,14.53 41.25,15.53 v43,15.53 v43,17.03 | v25.25,15.53 v25.25,16.53
  Bottom 0.25: v25.25,15.53 v43,15.53 | v25,8.03 v34.25,8.03 | v25.25,16.53 26,16.53 MODULE1.P$10 | MODULE2.P$10 v43,17.03
I2C1_SDA  (via drill 0.2)
  Top 0.25: v41.5,16.03 41,16.03 40,15.03 39.5,15.03 33,8.53 v32,8.53 | v23.25,16.03 v23.25,17.03 | v25.5,8.53 U1.59
  Bottom 0.25: v23.25,16.03 39.75,16.03 | 39.75,16.03 39.75,17.03 MODULE2.P$8 | v25.5,8.53 v32,8.53 | v23.25,17.03 MODULE1.P$8 | 39.75,16.03 v41.5,16.03
I2C2_SCL  (via drill 0.2)
  Top 0.25: U1.29 v22,11.53 | v58.75,12.53 v58.75,16.53
  Bottom 0.25: v22,11.53 22,12.53 v58.75,12.53 73.25,12.53 73.25,17.03 MODULE4.P$10 | v58.75,16.53 58,16.53 MODULE3.P$10
I2C2_SDA  (via drill 0.2)
  Top 0.25: U1.30 v21.5,7.03 | v57.75,16.03 v57.75,7.03 | v72,7.03 v72,13.03
  Bottom 0.25: MODULE3.P$8 56,16.03 v57.75,16.03 | v21.5,7.03 v57.75,7.03 v72,7.03 | v72,13.03 MODULE4.P$8
LCD_A0_(GPIO)  (via drill 0.2)
  Top 0.25: X2.8 v49.5,6.53 | U1.8 v31,6.53
  Bottom 0.25: v49.5,6.53 v31,6.53
LCD_BL_(GPIO)  (via drill 0.2)
  Top 0.25: U1.56 v24,2.03 | R19.2 v51.5,15.53 | v48,15.53 v48,2.03
  Bottom 0.25: v24,2.03 v48,2.03 | v51.5,15.53 v48,15.53
LCD_CS_(SPI3_NSS)  (via drill 0.2)
  Top 0.25: U1.50 21,2.28 20.75,2.53 20.75,10.53 21,10.78 v21,11.28 | X2.10 v51.5,12.03 | v54.5,13.03 v54.5,12.03
  Bottom 0.25: v21,11.28 21,13.03 v54.5,13.03 | v54.5,12.03 v51.5,12.03
LCD_MOSI_(SPI3_MOSI)  (via drill 0.2)
  Top 0.25: X2.6 v47.5,12.03 | U1.57 v24.5,11.28
  Bottom 0.25: v24.5,11.28 24.5,12.03 v47.5,12.03
LCD_RST_(GPIO)  (via drill 0.2)
  Top 0.25: X2.9 v50.5,3.03 | U1.2 v31,3.53
  Bottom 0.25: v31,3.53 31.5,3.03 v50.5,3.03
LCD_SCK_(SPI3_SCK_SWO)  (via drill 0.2)
  Top 0.25: X2.7 v48.5,2.53 | U1.55 v23.5,2.53
  Top 0.254: v23.5,2.53 23.5,4.28 21.5,6.28 v21.25,6.28
  Bottom 0.25: v23.5,2.53 v48.5,2.53
  Bottom 0.254: J2.6 9.25,37.53 11.25,37.53 11.25,38.03 13.5,38.03 13.5,9.28 15.75,7.03 20.5,7.03 v21.25,6.28
MOD1_GPIO1
  Top 0.25: U1.24 24.5,13.53 25.25,13.53 25.25,14.28 MODULE1.P$11
MOD2_GPIO0  (via drill 0.2)
  Top 0.25: U1.15 30.75,10.03 v35.25,14.53 | v38.25,14.53 39.25,15.53 39.75,15.53 41.25,17.03 MODULE2.P$9
  Bottom 0.25: v38.25,14.53 v35.25,14.53
MOD2_GPIO1  (via drill 0.2)
  Top 0.25: U1.11 30.75,8.03 31.75,9.03 32.75,9.03 v37.25,13.53 | v46,13.53 46,15.53 44.5,17.03 MODULE2.P$11
  Bottom 0.25: v37.25,13.53 v46,13.53
MOD3_GPIO1  (via drill 0.2)
  Top 0.25: v60,8.53 MODULE3.P$11 | v33.75,8.53 33.25,8.03 31.5,8.03 31,7.53 U1.10
  Bottom 0.25: v33.75,8.53 v60,8.53
MOD4_GPIO0  (via drill 0.2)
  Top 0.25: U1.25 v24,6.03 | v76.5,6.03 76.5,15.28 74,15.28 MODULE4.P$9
  Bottom 0.25: v24,6.03 v76.5,6.03
MOD4_GPIO1  (via drill 0.2)
  Top 0.25: U1.27 v23,5.53 | v77.25,5.53 77.25,15.78 76,15.78 MODULE4.P$11
  Bottom 0.25: v23,5.53 v77.25,5.53
N$1
  Top 0.406: 12.95,20.28 12.95,20.48 C4.1
  Top 0.5: U4.4 13,19.28 13,20.28 12.95,20.28
N$4
  Top 0.305: R19.1 X2.11
N$5
  Top 0.5: J15.P$1 J14.P$1 J16.P$1 46,37.03 39,37.03 J4.2
N$10
  3.3V 1: 0.7,14.93 1.3,14.93
N$12
  3.3V 1: 3.7,15.73 3.7,16.13
N$13
  Top 0.5: J26.P$1 J6.P$1 J27.P$1 62,37.03 55,37.03 J5.2
N$14
  3.3V 1: 0.7,21.93 1.3,21.93
N$16  (via drill 0.2)
  Top 0.25: R25.1 v82.5,8.53
  Bottom 0.25: v82.5,8.53 U$3.P$1
N$25
  Top 0.406: IC1.2 25,34.07 25,39.03 28,39.03 U$7.P$1
N$26
  Top 0.406: IC1.1 21.5,35.34 21.5,40.53 20,40.53 U$7.P$2
N$37
  Top 0.305: X2.3 C35.1
N$38
  Top 0.305: X2.2 C35.2
N$39
  Top 0.305: C36.2 42.5,13.28 X2.1
N$42
  Top 0.5: J18.P$1 J7.P$1 J17.P$1 34,37.03 37,40.03 J4.1
N$43
  Top 0.5: J29.P$1 J19.P$1 J28.P$1 50,37.03 53,40.03 J5.1
N$45  (via drill 0.6)
  Top 0.5: J20.P$1 58,35.03 57,34.03 v57,24.03
  Bottom 0.5: v57,24.03 58,23.03 MODULE7.P$6
N$47  (via drill 0.6)
  Top 0.5: J21.P$1 59,32.03 58,31.03 58,27.03 60,25.03 v60,24.03
  Bottom 0.5: v60,24.03 MODULE7.P$4
N$51  (via drill 0.6)
  Top 0.5: J8.P$1 42,35.03 41,34.03 v41,24.03
  Bottom 0.5: v41,24.03 42,23.03 MODULE6.P$6
N$52  (via drill 0.6)
  Top 0.5: J9.P$1 43,32.03 42,31.03 42,27.03 44,25.03 v44,24.03
  Bottom 0.5: v44,24.03 MODULE6.P$4
N$53  (via drill 0.6)
  Top 0.5: J10.P$1 37,32.03 38,31.03 v38,27.03
  Bottom 0.5: v38,27.03 43,27.03 46,24.03 MODULE6.P$2
N$54  (via drill 0.6)
  Top 0.5: J11.P$1 38,35.03 39,34.03 v39,24.03
  Bottom 0.5: v39,24.03 40,23.03 MODULE6.P$8
N$55
  Top 0.5: J13.P$1 44,27.03 46,25.03 46,24.03 44,22.03 MODULE6.P$3
N$56
  Top 0.5: J12.P$1 36,24.03 38,22.03 42,22.03 MODULE6.P$5
N$57  (via drill 0.6)
  Top 0.5: J22.P$1 53,32.03 54,31.03 v54,27.03
  Bottom 0.5: v54,27.03 59,27.03 62,24.03 MODULE7.P$2
N$58  (via drill 0.6)
  Top 0.5: J23.P$1 54,35.03 55,34.03 v55,24.03
  Bottom 0.5: v55,24.03 56,23.03 MODULE7.P$8
N$59
  Top 0.5: MODULE7.P$3 60,22.03 62,24.03 62,25.03 60,27.03 J25.P$1
N$60
  Top 0.5: MODULE7.P$5 58,22.03 54,22.03 52,24.03 J24.P$1
N$61
  Top 0.5: J39.P$1 J31.P$1 J40.P$1 78,37.03 71,37.03 J30.2
N$62
  Top 0.5: J42.P$1 J32.P$1 J41.P$1 66,37.03 69,40.03 J30.1
N$63  (via drill 0.6)
  Top 0.5: J33.P$1 74,35.03 73,34.03 v73,24.03
  Bottom 0.5: v73,24.03 74,23.03 MODULE8.P$6
N$64  (via drill 0.6)
  Top 0.5: J34.P$1 75,32.03 74,31.03 74,27.03 76,25.03 v76,24.03
  Bottom 0.5: v76,24.03 MODULE8.P$4
N$65  (via drill 0.6)
  Top 0.5: J35.P$1 69,32.03 70,31.03 v70,27.03
  Bottom 0.5: v70,27.03 75,27.03 78,24.03 MODULE8.P$2
N$66  (via drill 0.6)
  Top 0.5: J36.P$1 70,35.03 71,34.03 v71,24.03
  Bottom 0.5: v71,24.03 72,23.03 MODULE8.P$8
N$67
  Top 0.5: J38.P$1 76,27.03 78,25.03 78,24.03 76,22.03 MODULE8.P$3
N$68
  Top 0.5: MODULE8.P$5 74,22.03 70,22.03 68,24.03 J37.P$1
NRST  (via drill 0.2)
  Top 0.25: U1.7 28.75,6.03 28.75,4.28 v28,3.53 | C3.1 12.25,39.28 11.75,38.78 v11.75,37.53 | v7,11.03 v13,11.03
  Bottom 0.25: v28,3.53 21,3.53 19,1.53 12.25,1.53 7,6.78 v7,11.03 | J2.10 11.75,37.62 v11.75,37.53 11.75,36.41 J2.10 | v13,11.03 13,36.28 11.88,36.28 J2.10
OSC_IN
  Top 0.25: U1.5 31.75,5.03 33,6.28 C20.1 35,6.28 Y1.P$2
OSC_OUT
  Top 0.25: U1.6 31.5,5.53 33,7.03 37.5,7.03 37.5,6.28 | 37.5,6.28 Y1.P$1 | C19.1 37.5,6.28
PULLBACK_1
  3.3V 1: 3.7,20.73 3.7,21.13
RTC_BAT  (via drill 0.2)
  Top 0.25: U1.1 31.25,3.03 32.75,1.53 48.5,1.53 v49.5,2.53
  Bottom 0.25: v49.5,2.53 66.25,2.53 66.5,2.28 77.5,2.28 77.75,2.53 88.5,2.53 BAT1.PWR@1
RTC_OSC_IN
  Top 0.25: U1.3 31.5,4.03 33.25,2.28 37.5,2.28 37.5,3.03 | Y3.P$2 37.5,3.03 | C9.1 37.5,3.03
RTC_OSC_OUT
  Top 0.25: U1.4 31.75,4.53 33.25,3.03 C6.1 35,3.03 Y3.P$1
SCL_1  (via drill 0.6)
  Top 0.406: IC1.8 27.94,26.4 TP2.P$1 | v24,48.53 24.95,47.98 U$4.4
  Bottom 0.406: MODULE5.P$6 26,20.95 TP2.P$1 25,25.83 25,48.03 v24,48.53
SD_DETECT  (via drill 0.2)
  Top 0.25: U1.9 31.25,7.03 31.75,7.53 34.5,7.53 35.5,8.53 36,8.53 v36.5,8.03 | v66.25,8.03 66.25,14.13 J1.9
  Bottom 0.25: v36.5,8.03 v66.25,8.03
SDA_1  (via drill 0.6)
  Top 0.406: IC1.7 22.86,26.25 TP1.P$1 | v24,47.03 23.05,46.48 U$4.5
  Bottom 0.406: MODULE5.P$8 24,21.75 TP1.P$1 23,23.03 23,46.53 v24,47.03
SDIO_CLK  (via drill 0.2)
  Top 0.25: 22.5,1.03 U1.53 v22.5,4.53 | v62.5,4.53 R7.1
  Top 0.254: v70.75,4.53 70.75,14.13 J1.5
  Bottom 0.25: v22.5,4.53 31.75,4.53 32.25,4.03 51.25,4.03 51.75,4.53 v62.5,4.53 v70.75,4.53
SDIO_CMD  (via drill 0.2)
  Top 0.25: U1.54 v23,4.03 | v61,4.03 R14.1
  Top 0.254: v73,4.03 73,14.13 J1.3
  Bottom 0.25: v23,4.03 31.5,4.03 32,3.53 51.5,3.53 52,4.03 v61,4.03 v73,4.03
SDIO_D0  (via drill 0.2)
  Top 0.25: U1.39 v17.5,7.53 | v65,7.53 65,6.53 R13.1
  Top 0.254: v68.5,7.53 68.5,14.13 J1.7
  Bottom 0.25: v17.5,7.53 v65,7.53 v68.5,7.53
SPI1_MISO  (via drill 0.2)
  Top 0.25: v54,9.03 MODULE3.P$5 | v69,9.03 v69,13.03 | v69,17.03 MODULE4.P$5 | U1.22 25.5,9.28 v25.25,9.03
  Bottom 0.25: v25.25,9.03 v54,9.03 v69,9.03 | v69,13.03 v69,17.03
SPI1_MOSI  (via drill 0.2)
  Top 0.25: v68,15.53 MODULE4.P$3 | U1.23 v25,11.03 | MODULE3.P$3 51,17.03 v51,10.53 | v68,10.53 v68,13.03
  Bottom 0.25: v25,11.03 25,10.53 v51,10.53 v68,10.53 | v68,13.03 v68,15.53
SPI1_SCK  (via drill 0.2)
  Top 0.25: v71.25,17.03 MODULE4.P$7 | U1.21 v26,11.03 | v58.25,11.03 v58.25,15.58 | v56,15.58 MODULE3.P$7 | v71.25,11.03 v71.25,13.03
  Bottom 0.25: v26,11.03 v58.25,11.03 v71.25,11.03 | v71.25,13.03 v71.25,17.03 | v56,15.58 v58.25,15.58
SPI2_MISO  (via drill 0.2, 0.2 pad 0.25)
  Top 0.25: v32.25,14.53 33.25,15.53 35.75,15.53 36.75,16.53 36.75,17.03 MODULE2.P$5 | U1.35 17.25,9.53 16.5,10.28 v16.5,14.53 | v22,14.53 MODULE1.P$5
  Bottom 0.25: v32.25,14.53 v22,14.53 v16.5,14.53
SPI2_MOSI  (via drill 0.2, 0.2 pad 0.25)
  Top 0.25: MODULE1.P$3 v20,15.03 | MODULE2.P$3 35.25,17.03 34.25,16.03 33,16.03 v32,15.03 | U1.36 17,9.03 16,10.03 v16,15.03
  Bottom 0.25: v32,15.03 v20,15.03 v16,15.03
SPI2_SCK  (via drill 0.2, 0.2 pad 0.25)
  Top 0.25: v36.5,13.53 MODULE2.P$7 | U1.34 17.5,10.03 17,10.53 v17,13.53 | MODULE1.P$7 v24,13.53
  Bottom 0.25: v36.5,13.53 v24,13.53 v17,13.53
SW_A  (via drill 0.2)
  Top 0.25: U1.52 v22,2.28 | R8.2 v57,2.03 | v88,2.03 88,38.11 S3.3
  Bottom 0.25: v22,2.28 22,1.53 48.25,1.53 48.75,2.03 v57,2.03 66,2.03 66.25,1.78 77.75,1.78 78,2.03 v88,2.03
SW_B  (via drill 0.2)
  Top 0.25: U1.51 v21.5,2.53 | R11.2 v58.5,1.53 | S2.3 88.5,23.63 v88.5,1.53
  Bottom 0.25: v21.5,2.53 21.5,1.03 48.5,1.03 49,1.53 v58.5,1.53 65.75,1.53 66,1.28 78,1.28 78.25,1.53 v88.5,1.53
SW_C  (via drill 0.2)
  Top 0.25: U1.38 20,8.03 v20,1.03 | R12.2 v60,1.03 | v89,1.03 89,9.15 S1.3
  Bottom 0.25: v20,1.03 20,0.53 48.75,0.53 49.25,1.03 v60,1.03 65.5,1.03 65.75,0.78 78.25,0.78 78.5,1.03 v89,1.03
SW_D_(BOOT0)  (via drill 0.2)
  Top 0.25: U1.41 v16.75,6.53 R15.2 | S4.3 1.26,38.03 1.25,38.03 | 1.5,38.03 v3,38.03 | U1.60 v26,3.03 | R3.2 9.25,1.78 9,2.03 v9,3.28 | v6,8.28 8.75,8.28 9,8.53 10.5,8.53 v10.5,8.28
  Top 0.406: 1.26,38.03 1.5,38.03
  Bottom 0.25: v16.75,6.53 15.25,5.03 12.5,5.03 10.5,7.03 v10.5,8.28 10.5,19.78 2,28.28 2,33.28 2.5,33.78 2.5,38.03 v3,38.03 | v26,3.03 21.25,3.03 18.75,0.53 11.75,0.53 v9,3.28 6,6.28 v6,8.28
SW_E_(BOOT1)  (via drill 0.2)
  Top 0.25: U1.28 v22.5,6.03 | S5.3 6.34,26.28 v2.75,26.28 | v14.5,2.53 14.25,2.78 R16.2
  Bottom 0.25: v22.5,6.03 19.5,3.03 16,3.03 15.5,2.53 v14.5,2.53 12,2.53 7.5,7.03 7.5,19.28 2.75,24.03 v2.75,26.28
SW_PWR_(SYS_WKUP)  (via drill 0.2)
  Top 0.25: U1.14 27.5,9.53 v27.5,6.53 | v12.5,3.53 11.75,3.53 | 1.26,12.52 S6.1 | 11.75,3.53 8,7.28 6.5,7.28 1.26,12.52 | R1.2 11.75,3.53 | 1.26,12.52 1.25,12.53
  Bottom 0.25: v27.5,6.53 22.25,6.53 19.25,3.53 v12.5,3.53
SWCLK  (via drill 0.2)
  Top 0.25: U1.49 20.5,0.53 19.5,0.53 19.5,1.03 v18.5,1.03 | R2.1 10.75,3.03 9.5,4.28 v8.75,4.28 | v6.5,12.03 v14,12.03 | v10,38.78 10,39.28 R18.1
  Bottom 0.25: v18.5,1.03 12,1.03 v8.75,4.28 | v8.75,4.28 6.5,6.53 v6.5,12.03 | v8.75,4.28 8.88,4.16 | v14,12.03 14,38.78 v10,38.78
SWDCLK_M  (via drill 0.2)
  Top 0.25: R18.2 11,38.03 v10.25,38.03 | v1.5,31.78 4,34.28 v8,34.28
  Bottom 0.25: v10.25,38.03 8.75,38.03 8.75,36.37 J2.4 8,36.35 v8,34.28 | TP6.P$1 0.98,31.26 v1.5,31.78
SWDIO  (via drill 0.2)
  Top 0.25: U1.46 14.75,4.03 14.75,3.53 | 14.75,3.53 v14.75,3.03 | R4.1 12.75,3.03 13.25,3.53 14.75,3.53 | v3.75,24.53 7.5,24.53 7.5,28.03 7.25,28.28 v7.25,33.03 | v7.25,35.28 7.25,36.53 R20.1
  Bottom 0.25: v14.75,3.03 12.25,3.03 8,7.28 8,19.53 3.75,23.78 v3.75,24.53 | v7.25,33.03 v7.25,35.28
SWDIO_M  (via drill 0.2)
  Top 0.25: R20.2 v8,38.28 | v1,29.28 1,32.78 3,34.78 v6.75,34.78
  Bottom 0.25: v8,38.28 7.25,38.28 7.25,36.28 6.71,36.28 J2.2 6.75,36.16 v6.75,34.78 | TP5.P$1 1,28.28 v1,29.28
USART1_RX  (via drill 0.2)
  Top 0.25: U1.43 v17.25,5.53 | v8.5,9.03 v14.5,9.03 | J3.2 3.5,32.11 5,33.53 v14.5,33.53
  Bottom 0.25: v17.25,5.53 15.75,4.03 12,4.03 8.5,7.53 v8.5,9.03 | v14.5,9.03 v14.5,33.53 14.5,40.28 14,40.78 13,40.78 12.25,40.03 v10.5,40.03
  Bottom 0.254: v10.5,40.03 10.5,41.18 J2.7
USART1_TX  (via drill 0.2)
  Top 0.25: U1.42 v17,6.03 | v9,11.53 v12.5,11.53
  Bottom 0.25: v17,6.03 15.5,4.53 12.25,4.53 9,7.78 v9,11.53 | v12.5,11.53 12.5,29.53 | 12.5,29.53 12.5,35.28 10.5,35.28 10.5,35.53 | J3.7 12.48,29.51 12.5,29.53
  Bottom 0.254: 10.5,35.53 10.5,36.39 J2.8
USART2_RX  (via drill 0.2)
  Top 0.25: v28.75,17.03 28.75,16.03 28,15.28 28,14.53 | U1.17 28,14.53 | v76,6.53 v76,12.53 | v59.25,17.03 v59.25,6.53 | v44,4.53 v44,11.53 v44,15.53 | 28,14.53 31,14.53 31,11.78 v30.75,11.53 | v51,6.53 v51,4.53
  Bottom 0.25: v28.75,17.03 MODULE1.P$12 | v76,6.53 v59.25,6.53 v51,6.53 | v76,12.53 MODULE4.P$12 | MODULE3.P$12 v59.25,17.03 | v44,15.53 MODULE2.P$12 | v30.75,11.53 v44,11.53 | v44,4.53 v51,4.53
USART2_TX  (via drill 0.2)
  Top 0.25: v61.25,16.53 v61.25,11.53 | v45,15.53 v45,11.53 | U1.16 30.5,10.53 31.5,11.53 31.5,13.03 | 31.5,13.03 v31.5,16.78 | v78,11.53 v78,15.78 | v33.5,15.03 32.25,13.78 31.5,13.03
  Bottom 0.25: v45,11.53 v61.25,11.53 v78,11.53 | MODULE1.P$14 30,16.78 v31.5,16.78 | MODULE3.P$14 62,16.53 v61.25,16.53 | MODULE2.P$14 45,17.03 v45,15.53 45,15.03 v33.5,15.03 | v78,15.78 MODULE4.P$14
USB_DM  (via drill 0.2)
  Top 0.25: U1.44 11.75,5.03 10,6.78 v10,7.53 | v9,20.53 R10.2
  Bottom 0.25: v10,7.53 10,19.53 v9,20.53
USB_DP  (via drill 0.2)
  Top 0.25: U1.45 11.5,4.53 9.5,6.53 v9.5,8.03 | v9.5,19.03 R9.2
  Bottom 0.25: v9.5,8.03 v9.5,19.03
VBAT_1/2  (via drill 0.2)
  Top 0.25: 81.5,10.28 R25.2 | U1.26 v23.5,5.03 | v79,5.03 79,10.28 81.5,10.28 | 81.5,10.28 R26.1
  Bottom 0.25: v23.5,5.03 v79,5.03
VBUS  (via drill 0.2)
  Top 0.25: U1.40 15.25,7.03 14.75,7.53 v14.5,7.53 | v12,12.53 C1.2
  Top 0.305: C1.2 C2.2 12,15.03
  Top 0.5: U4.1 10.8,15.03 | D3.C 8.5,15.03 D2.C 10.8,15.03 | U4.3 12.7,15.03 12,15.03 10.8,15.03
  Bottom 0.25: v12,12.53 12,8.78 13.25,8.78 v14.5,7.53
VBUS_IN
  Top 0.406: U$1.PIN$1 2.4,19.72 2.4,19.53
  Top 0.61: 2.4,19.53 2.4,14.73 5.6,14.73 D2.A
WIFI_EN  (via drill 0.2)
  Top 0.25: U1.37 16.25,8.53 15.25,9.53 v11.5,9.53 | v4.7,27.08 4.7,30.77 J3.4
  Bottom 0.25: v11.5,9.53 11.5,11.03 11,11.53 11,20.03 4.7,26.33 v4.7,27.08

### Text on the board
tPlace: 100nF | SDA | SCL | SDA | SCL | SDA | SCL | TX | RX | TX | RX | TX | RX | 1uF | 100nF | D0 | D1 | D0 | D1 | D0 | D1 | MCP3424 | 3.3V | GND | SDA | SCL
bPlace: MCP9800 | 3.3V | GND | SDA | SCL | Pax Instruments | Armwiz / v0.1